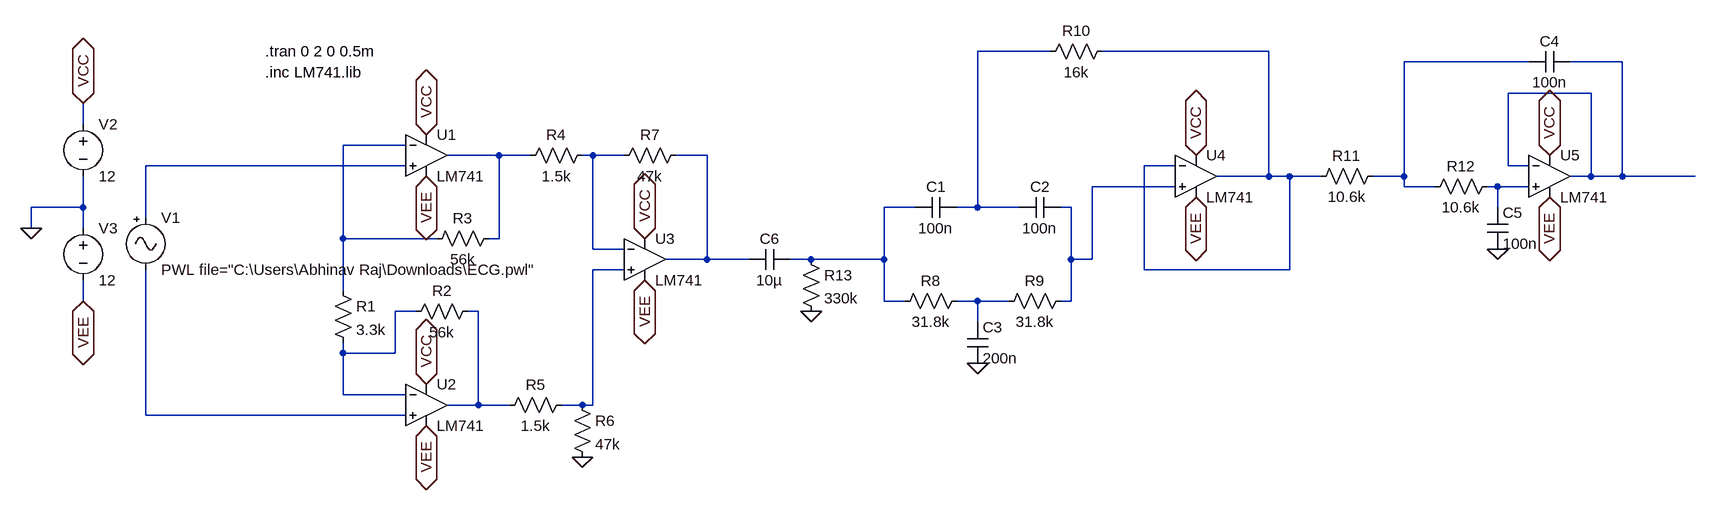
[diagram p0: schematic ASD_Project.asc]
ASD_Project.asc, the LTspice schematic file:
Version 4.1
SHEET 1 2132 680
WIRE 848 -96 736 -96
WIRE 1184 -96 928 -96
WIRE 1584 -80 1392 -80
WIRE 1728 -80 1648 -80
WIRE 1680 -32 1552 -32
WIRE -640 16 -640 -16
WIRE -144 48 -240 48
WIRE 0 64 -80 64
WIRE 48 64 0 64
WIRE 144 64 128 64
WIRE 192 64 144 64
WIRE 320 64 272 64
WIRE -144 80 -544 80
WIRE 1040 80 992 80
WIRE 1552 80 1552 -32
WIRE 1584 80 1552 80
WIRE 1184 96 1184 -96
WIRE 1184 96 1104 96
WIRE 1216 96 1184 96
WIRE 1264 96 1216 96
WIRE 1392 96 1392 -80
WIRE 1392 96 1344 96
WIRE 1680 96 1680 -32
WIRE 1680 96 1648 96
WIRE 1728 96 1728 -80
WIRE 1728 96 1680 96
WIRE 1840 96 1728 96
WIRE 1040 112 912 112
WIRE 1392 112 1392 96
WIRE 1440 112 1392 112
WIRE 1536 112 1520 112
WIRE 1584 112 1536 112
WIRE -640 144 -640 96
WIRE -640 144 -720 144
WIRE 640 144 592 144
WIRE 736 144 736 -96
WIRE 736 144 704 144
WIRE 800 144 736 144
WIRE 880 144 864 144
WIRE 1536 144 1536 112
WIRE -544 160 -544 80
WIRE -720 176 -720 144
WIRE -640 176 -640 144
WIRE -240 192 -240 48
WIRE -96 192 -240 192
WIRE 0 192 0 64
WIRE 0 192 -16 192
WIRE 144 208 144 64
WIRE 192 208 144 208
WIRE 320 224 320 64
WIRE 320 224 256 224
WIRE 384 224 320 224
WIRE 480 224 448 224
WIRE 592 224 592 144
WIRE 592 224 480 224
WIRE 880 224 880 144
WIRE 912 224 912 112
WIRE 912 224 880 224
WIRE 192 240 144 240
WIRE 992 240 992 80
WIRE 1216 240 1216 96
WIRE 1216 240 992 240
WIRE -240 272 -240 192
WIRE -640 288 -640 256
WIRE 592 288 592 224
WIRE 624 288 592 288
WIRE 736 288 704 288
WIRE 784 288 736 288
WIRE 880 288 880 224
WIRE 880 288 864 288
WIRE -128 304 -160 304
WIRE -32 304 -48 304
WIRE 736 320 736 288
WIRE -240 368 -240 352
WIRE -160 368 -160 304
WIRE -160 368 -240 368
WIRE -240 432 -240 368
WIRE -144 432 -240 432
WIRE -32 448 -32 304
WIRE -32 448 -80 448
WIRE 16 448 -32 448
WIRE 128 448 96 448
WIRE 144 448 144 240
WIRE 144 448 128 448
WIRE -544 464 -544 240
WIRE -144 464 -544 464
FLAG -112 32 VCC
IOPIN -112 32 BiDir
FLAG -112 96 VEE
IOPIN -112 96 BiDir
FLAG -640 -16 VCC
IOPIN -640 -16 BiDir
FLAG -640 288 VEE
IOPIN -640 288 BiDir
FLAG -720 176 0
FLAG -112 416 VCC
IOPIN -112 416 BiDir
FLAG -112 480 VEE
IOPIN -112 480 BiDir
FLAG 224 192 VCC
IOPIN 224 192 BiDir
FLAG 224 256 VEE
IOPIN 224 256 BiDir
FLAG 128 528 0
FLAG 1072 64 VCC
IOPIN 1072 64 BiDir
FLAG 1072 128 VEE
IOPIN 1072 128 BiDir
FLAG 736 384 0
FLAG 1616 64 VCC
IOPIN 1616 64 BiDir
FLAG 1616 128 VEE
IOPIN 1616 128 BiDir
FLAG 480 304 0
FLAG 1536 208 0
SYMBOL OpAmps\\opamp2 -112 0 R0
SYMATTR InstName U1
SYMATTR Value LM741
SYMBOL voltage -640 0 R0
WINDOW 123 0 0 Left 0
WINDOW 39 0 0 Left 0
SYMATTR InstName V2
SYMATTR Value 12
SYMBOL voltage -640 160 R0
WINDOW 123 0 0 Left 0
WINDOW 39 0 0 Left 0
SYMATTR InstName V3
SYMATTR Value 12
SYMBOL OpAmps\\opamp2 -112 384 R0
SYMATTR InstName U2
SYMATTR Value LM741
SYMBOL OpAmps\\opamp2 224 160 R0
SYMATTR InstName U3
SYMATTR Value LM741
SYMBOL res -256 256 R0
SYMATTR InstName R1
SYMATTR Value 3.3k
SYMBOL res -32 288 R90
WINDOW 0 0 56 VBottom 2
WINDOW 3 32 56 VTop 2
SYMATTR InstName R2
SYMATTR Value 56k
SYMBOL res 0 176 R90
WINDOW 0 0 56 VBottom 2
WINDOW 3 32 56 VTop 2
SYMATTR InstName R3
SYMATTR Value 56k
SYMBOL res 144 48 R90
WINDOW 0 0 56 VBottom 2
WINDOW 3 32 56 VTop 2
SYMATTR InstName R4
SYMATTR Value 1.5k
SYMBOL res 112 432 R90
WINDOW 0 0 56 VBottom 2
WINDOW 3 32 56 VTop 2
SYMATTR InstName R5
SYMATTR Value 1.5k
SYMBOL res 112 432 R0
SYMATTR InstName R6
SYMATTR Value 47k
SYMBOL res 176 80 R270
WINDOW 0 32 56 VTop 2
WINDOW 3 0 56 VBottom 2
SYMATTR InstName R7
SYMATTR Value 47k
SYMBOL OpAmps\\opamp2 1072 32 R0
SYMATTR InstName U4
SYMATTR Value LM741
SYMBOL cap 704 128 R90
WINDOW 0 0 32 VBottom 2
WINDOW 3 32 32 VTop 2
SYMATTR InstName C1
SYMATTR Value 100n
SYMBOL cap 864 128 R90
WINDOW 0 0 32 VBottom 2
WINDOW 3 32 32 VTop 2
SYMATTR InstName C2
SYMATTR Value 100n
SYMBOL res 720 272 R90
WINDOW 0 0 56 VBottom 2
WINDOW 3 32 56 VTop 2
SYMATTR InstName R8
SYMATTR Value 31.8k
SYMBOL res 880 272 R90
WINDOW 0 0 56 VBottom 2
WINDOW 3 32 56 VTop 2
SYMATTR InstName R9
SYMATTR Value 31.8k
SYMBOL cap 720 320 R0
SYMATTR InstName C3
SYMATTR Value 200n
SYMBOL res 944 -112 R90
WINDOW 0 0 56 VBottom 2
WINDOW 3 32 56 VTop 2
SYMATTR InstName R10
SYMATTR Value 16k
SYMBOL OpAmps\\opamp2 1616 32 R0
SYMATTR InstName U5
SYMATTR Value LM741
SYMBOL res 1360 80 R90
WINDOW 0 0 56 VBottom 2
WINDOW 3 32 56 VTop 2
SYMATTR InstName R11
SYMATTR Value 10.6k
SYMBOL cap 1648 -96 R90
WINDOW 0 0 32 VBottom 2
WINDOW 3 32 32 VTop 2
SYMATTR InstName C4
SYMATTR Value 100n
SYMBOL res 1536 96 R90
WINDOW 0 0 56 VBottom 2
WINDOW 3 32 56 VTop 2
SYMATTR InstName R12
SYMATTR Value 10.6k
SYMBOL Misc\\signal -544 144 R0
WINDOW 123 0 0 Left 0
WINDOW 39 0 0 Left 0
SYMATTR InstName V1
SYMATTR Value PWL file="C:\Users\Abhinav Raj\Downloads\ECG.pwl"
SYMBOL cap 448 208 R90
WINDOW 0 0 32 VBottom 2
WINDOW 3 32 32 VTop 2
SYMATTR InstName C6
SYMATTR Value 10µ
SYMBOL res 464 208 R0
SYMATTR InstName R13
SYMATTR Value 330k
SYMBOL cap 1520 144 R0
SYMATTR InstName C5
SYMATTR Value 100n
TEXT -360 -96 Left 2 !.tran 0 2 0 0.5m
TEXT -360 -64 Left 2 !.inc LM741.lib

The netlist it stands for:
* ASD_Project.asc
X§U1 N009 N005 VCC VEE N006 LM741  ; pins In+ In- V+ V- OUT
V2 VCC 0 12
V3 0 VEE 12
X§U2 N017 N015 VCC VEE N016 LM741  ; pins In+ In- V+ V- OUT
X§U3 N013 N007 VCC VEE N008 LM741  ; pins In+ In- V+ V- OUT
R1 N005 N015 3.3k
R2 N016 N015 56k
R3 N006 N005 56k
R4 N007 N006 1.5k
R5 N013 N016 1.5k
R6 N013 0 47k
R7 N007 N008 47k
X§U4 N010 N002 VCC VEE N002 LM741  ; pins In+ In- V+ V- OUT
C1 N001 N012 100n
C2 N010 N001 100n
R8 N014 N012 31.8k
R9 N010 N014 31.8k
C3 N014 0 200n
R10 N002 N001 16k
X§U5 N011 N004 VCC VEE N004 LM741  ; pins In+ In- V+ V- OUT
R11 N003 N002 10.6k
C4 N004 N003 100n
R12 N011 N003 10.6k
V1 N009 N017 PWL file="C:\Users\Abhinav Raj\Downloads\ECG.pwl"
C6 N012 N008 10µ
R13 N012 0 330k
C5 N011 0 100n
.tran 0 2 0 0.5m
.inc LM741.lib
.backanno
.end